# Altium schematic sheet Power Distribution Board.SchDoc
size A; Organization: Underwater Robotics; Address1: c/o Student Involvement; Address2: Campus Box 7306; Address3: 2016 Cates Ave. Raleigh, NC 27695; Revision: A1; SheetNumber: 1C; SheetTotal: 2C
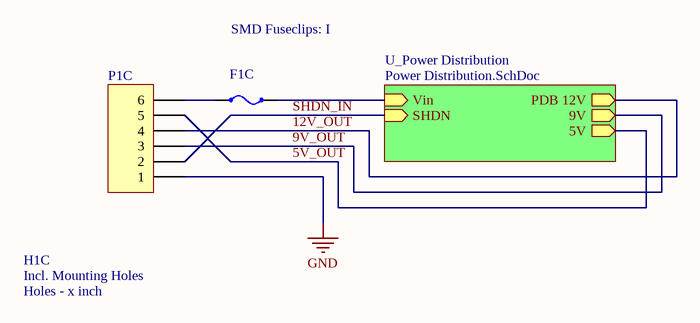
[diagram p0: Power Distribution Board.SchDoc]

## Parts
F1C  3569TR  [Horizontal SMD fuse clip]  (value not drawn)
H1C  Holes - x inch  [110mil Holes - 1.6 Inch]
i1C  3569TR (Placeholder)  (value not drawn)
P1C  MSTBA 2,5/ 6-G-5,08  [MSTBA 2,5 6-G-5,08]  (value not drawn)

## Sub-sheets
U_Power Distribution = Power Distribution.SchDoc: Vin (in), 9V (out), 5V (out), SHDN (in), PDB 12V (out)

## Nets
GND: P1C.1
5V_OUT: P1C.5 ; sheet U_Power Distribution/5V
9V_OUT: P1C.3 ; sheet U_Power Distribution/9V
12V_OUT: P1C.4 ; sheet U_Power Distribution/PDB 12V
SHDN_IN: P1C.2 ; sheet U_Power Distribution/SHDN
NetF1C_1: F1C.1 P1C.6
NetF1C_2: F1C.2 ; sheet U_Power Distribution/Vin

## Notes on the sheet
- Title
- Size:
- Date:
- A
- Number:
- Time:
- Revision:
- Sheet
- of
- File:
- (in symbol 3569TR (Placeholder)) SMD Fuseclips: I
- (in symbol Holes - x inch) Incl. Mounting Holes

## Library data of the parts
F1C = 3569TR: Fuse Clip Assembly; Manufacturer 1: KEYSTONE; Subassembly: Yes; Description 1: KEYSTONE - 3569TR - FUSE CLIP, AUTO BLADE, SMT; Supplier 1: Newark; Supplier Part Number 1: 24T5056; RoHS: YES; Stock 1: 1000; Pricing 1: 1=0.798, 50=0.672, 100=0.644, 250=0.589, 500=0.566, 1000=0.491, 2500=0.427, 5000=0.413 (USD); ComponentLink1URL: http://www.farnell.com/datasheets/1703973.pdf; ComponentLink1Description: http://www.farnell.com/datasheets/1703973.pdf; Manufacturer Part Number: 3569TR
i1C = 3569TR (Placeholder): Fuse Clip; Manufacturer 1: KEYSTONE; Subassembly: Yes; Description 1: KEYSTONE - 3569TR - FUSE CLIP, AUTO BLADE, SMT; Supplier 1: Newark; Supplier Part Number 1: 24T5056; RoHS: YES; Stock 1: 1000; Pricing 1: 1=0.798, 50=0.672, 100=0.644, 250=0.589, 500=0.566, 1000=0.491, 2500=0.427, 5000=0.413 (USD); ComponentLink1URL: http://www.farnell.com/datasheets/1703973.pdf; ComponentLink1Description: http://www.farnell.com/datasheets/1703973.pdf; Manufacturer Part Number: 3569TR
P1C = MSTBA 2,5/ 6-G-5,08: Header, 6-Pin; Manufacturer Part Number: 1757284; Manufacturer 1: Phoenix Contact; Description 1: Pluggable Terminal Blocks 6 Pos 5.08mm pitch Through Hole Header; Current Rating: 12 A; Number of Positions: 6 Position; Voltage Rating: 250 V; Pitch: 5.08 mm; Supplier 1: Mouser; Supplier Part Number 1: 651-1757284; RoHS: RoHS Compliant; Stock 1: 1398; Pricing 1: 1=2.64, 10=2.56, 25=2.51, 50=2.50, 100=2.34, 200=2.14, 500=1.98, 1000=1.89, 2000=1.76 (AUD); ComponentLink1URL: http://www.phoenixcontact.com/us/products/1757284/pdf; ComponentLink1Description: http://www.phoenixcontact.com/us/products/1757284/pdf; Category: Pluggable Terminal Blocks; Color: Gray; Contact Plating: Tin; Housing Material: Polybutylene Terephthalate (PBT); Packaging: Bulk; Product: Headers; Series: MSTBA; Termination Style: Through Hole; Brand: Phoenix Contact; Flammability Rating: UL 94 V-0; Product Category: Pluggable Standard Terminal Blocks; Standard Pack Qty: 50; Tradename: COMBICON Control; RoHS - Mouser: Y; Minimum Order Quantity: 1; Reeling: False